# Altium project SHERPA.PrjPcb
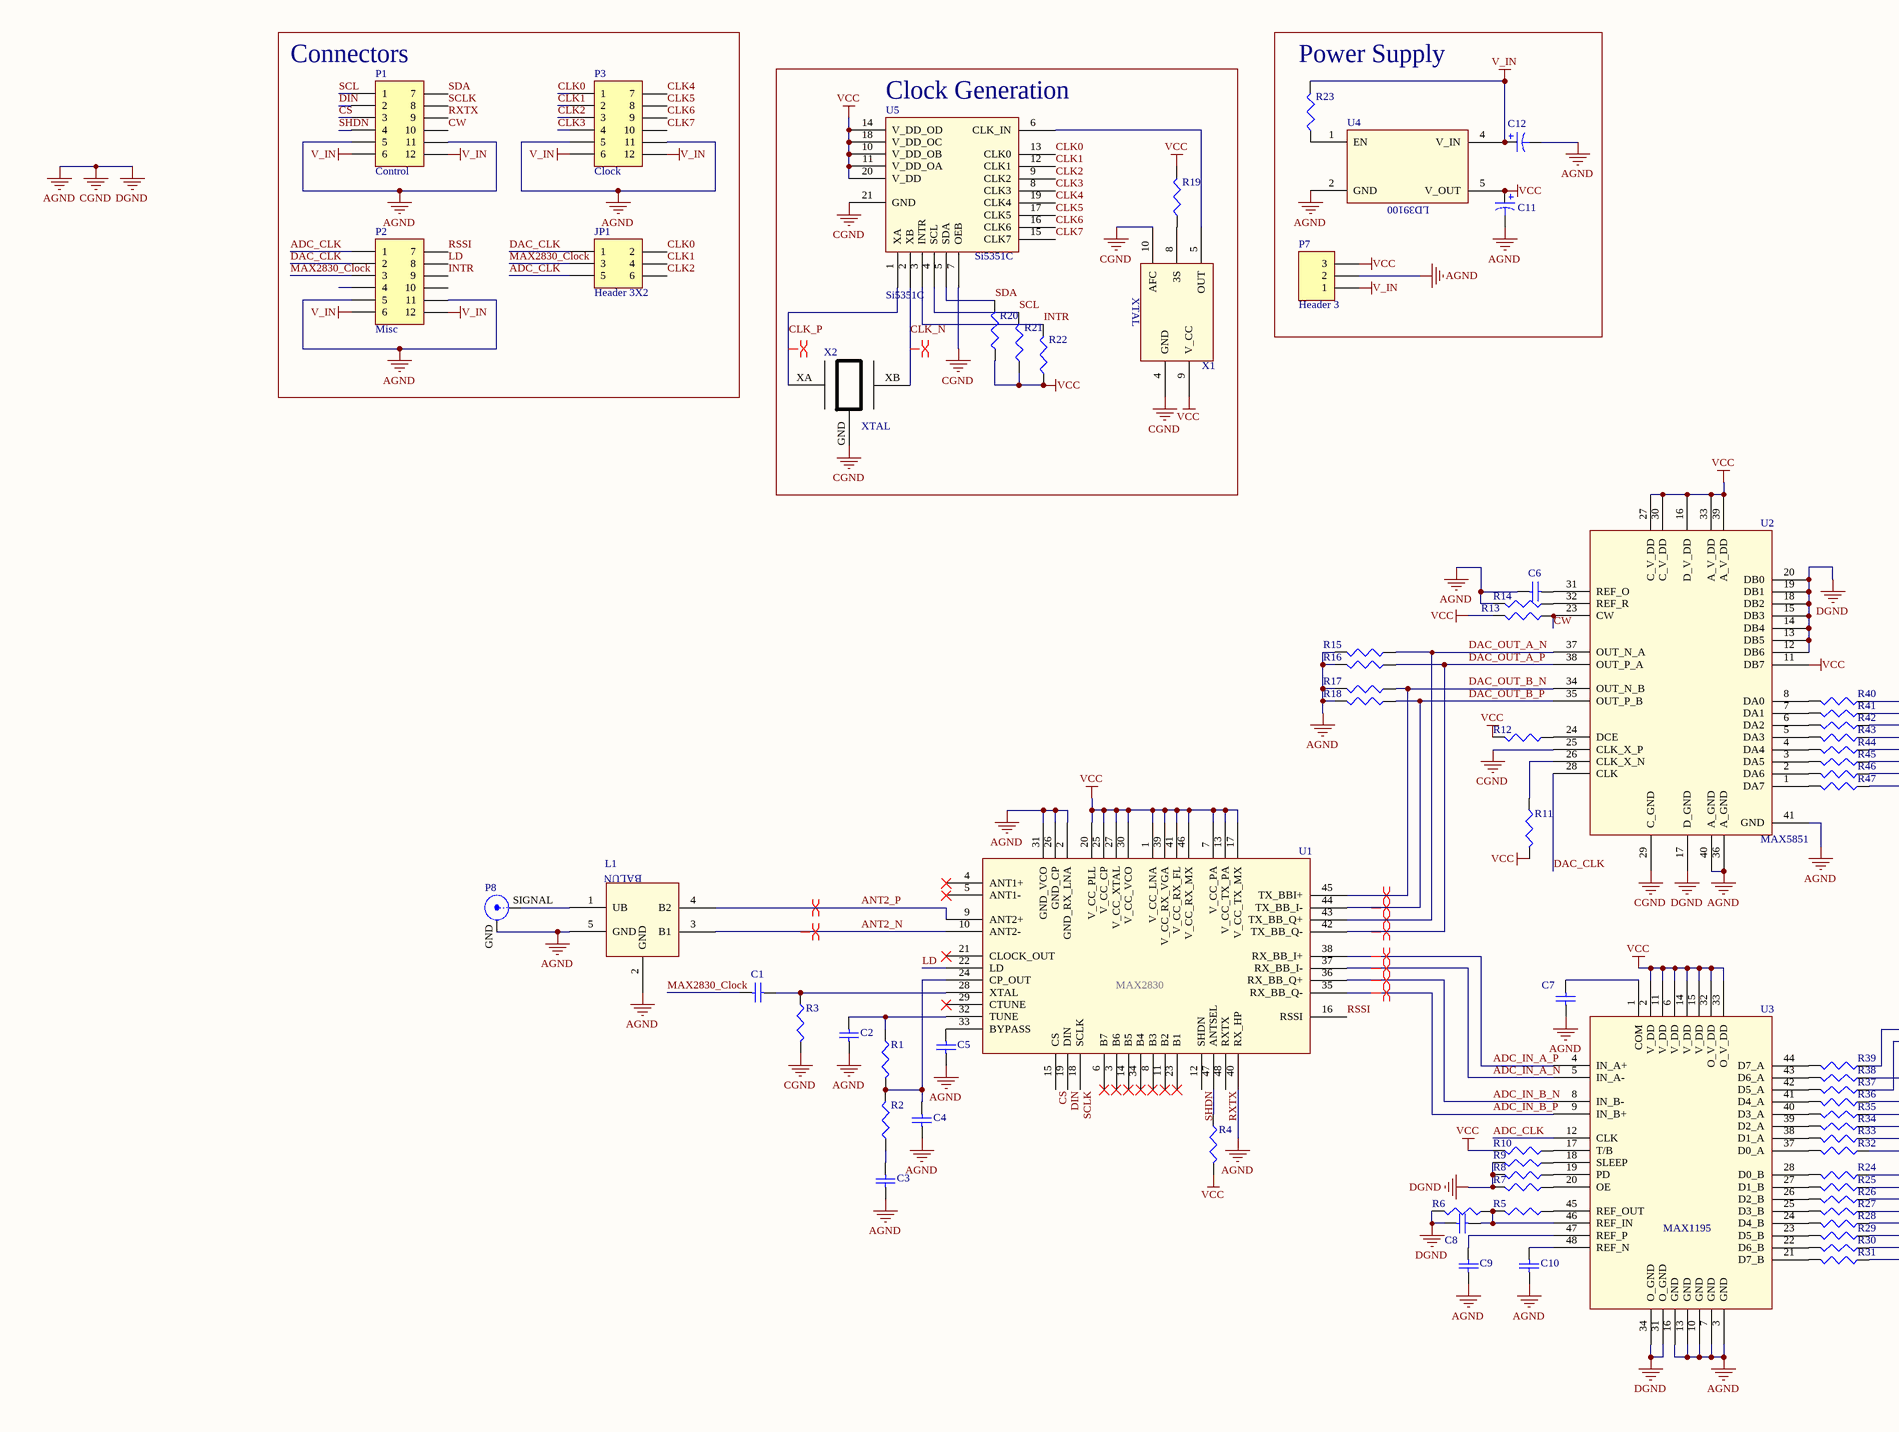
[diagram p0: Schematic_SHERPA.SchDoc, left]
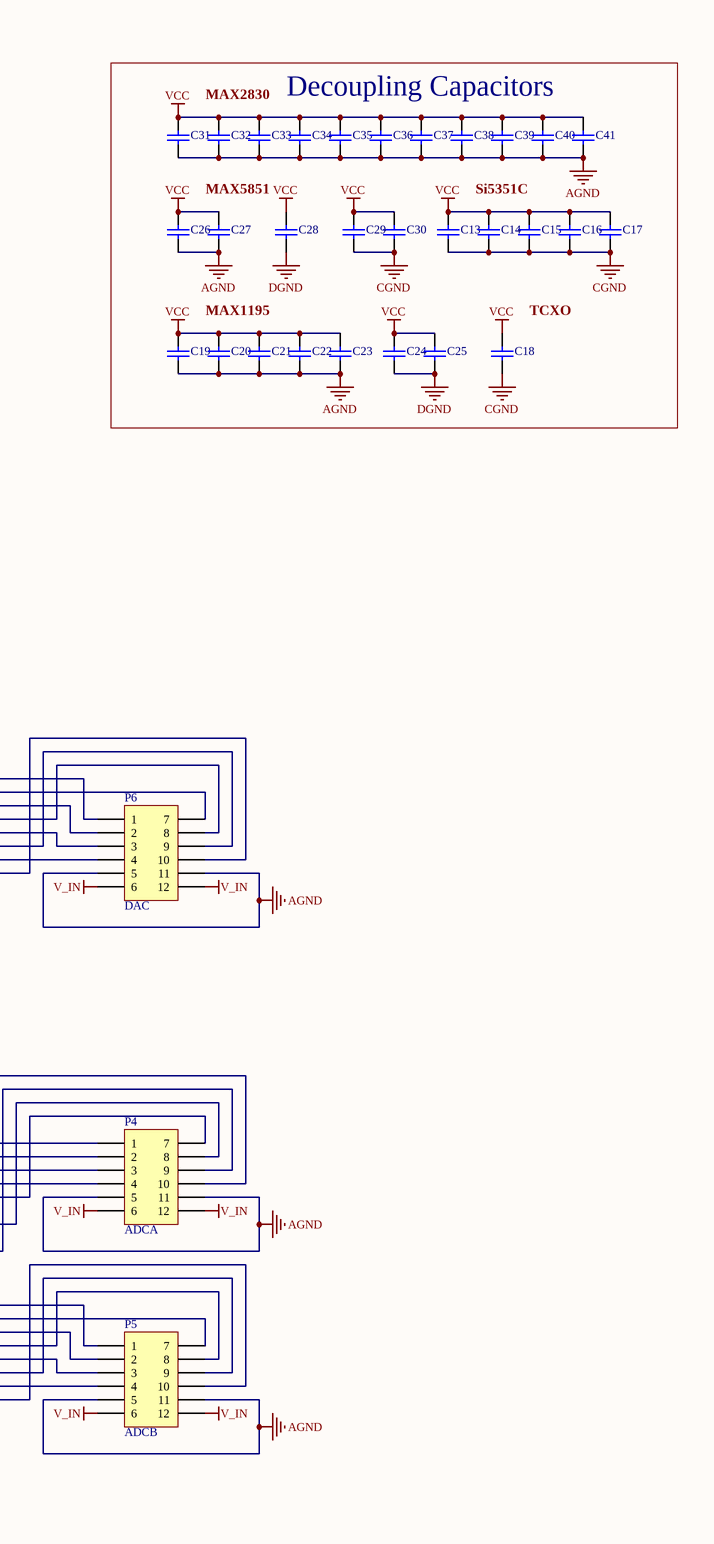
[diagram p1: Schematic_SHERPA.SchDoc, right]
1 sheet, 105 parts. Net scope: global (net labels, ports and power ports of the same name join across sheets).
Board files: PCB_SHERPA_MK_II.PcbDoc, PCB_SHERPA_MK_I.PcbDoc

## Sheet Schematic_SHERPA.SchDoc
size A2

### Parts
C1  Cap Semi  [0402]  (value not drawn)
C2  Cap Semi  [0402]  (value not drawn)
C3  Cap Semi  [0402]  (value not drawn)
C4  Cap Semi  [0402]  (value not drawn)
C5  Cap Semi  [0402]  (value not drawn)
C6  Cap Semi  [0402]  (value not drawn)
C7  Cap Semi  [0402]  (value not drawn)
C8  Cap Semi  [0402]  (value not drawn)
C9  Cap Semi  [0402]  (value not drawn)
C10  Cap Semi  [0402]  (value not drawn)
C11  Cap Pol3  [C0805]  (value not drawn)
C12  Cap Pol3  [C0805]  (value not drawn)
C13  Cap Semi  [0402]  (value not drawn)
C14  Cap Semi  [0402]  (value not drawn)
C15  Cap Semi  [0402]  (value not drawn)
C16  Cap Semi  [0402]  (value not drawn)
C17  Cap Semi  [0402]  (value not drawn)
C18  Cap Semi  [0402]  (value not drawn)
C19  Cap Semi  [0402]  (value not drawn)
C20  Cap Semi  [0402]  (value not drawn)
C21  Cap Semi  [0402]  (value not drawn)
C22  Cap Semi  [0402]  (value not drawn)
C23  Cap Semi  [0402]  (value not drawn)
C24  Cap Semi  [0402]  (value not drawn)
C25  Cap Semi  [0402]  (value not drawn)
C26  Cap Semi  [0402]  (value not drawn)
C27  Cap Semi  [0402]  (value not drawn)
C28  Cap Semi  [0402]  (value not drawn)
C29  Cap Semi  [0402]  (value not drawn)
C30  Cap Semi  [0402]  (value not drawn)
C31  Cap Semi  [0402]  (value not drawn)
C32  Cap Semi  [0402]  (value not drawn)
C33  Cap Semi  [0402]  (value not drawn)
C34  Cap Semi  [0402]  (value not drawn)
C35  Cap Semi  [0402]  (value not drawn)
C36  Cap Semi  [0402]  (value not drawn)
C37  Cap Semi  [0402]  (value not drawn)
C38  Cap Semi  [0402]  (value not drawn)
C39  Cap Semi  [0402]  (value not drawn)
C40  Cap Semi  [0402]  (value not drawn)
C41  Cap Semi  [0402]  (value not drawn)
JP1  Header 3X2  [HDR2X3]
L1  BALUN_2  [BALUN2]  (value not drawn)
P1  Control  [HDR2X6_CEN]
P2  Misc  [HDR2X6_CEN]
P3  Clock  [HDR2X6_CEN]
P4  ADCA  [HDR2X6_CEN]
P5  ADCB  [HDR2X6_CEN]
P6  DAC  [HDR2X6_CEN]
P7  Header 3  [HDR1X3]
P8  SMA  [SMA Connector]  (value not drawn)
R1  Res3  [0402]  (value not drawn)
R2  Res3  [0402]  (value not drawn)
R3  Res3  [0402]  (value not drawn)
R4  Res3  [0402]  (value not drawn)
R5  Res3  [0402]  (value not drawn)
R6  Res3  [0402]  (value not drawn)
R7  Res3  [0402]  (value not drawn)
R8  Res3  [0402]  (value not drawn)
R9  Res3  [0402]  (value not drawn)
R10  Res3  [0402]  (value not drawn)
R11  Res3  [0402]  (value not drawn)
R12  Res3  [0402]  (value not drawn)
R13  Res3  [0402]  (value not drawn)
R14  Res3  [0402]  (value not drawn)
R15  Res3  [0402]  (value not drawn)
R16  Res3  [0402]  (value not drawn)
R17  Res3  [0402]  (value not drawn)
R18  Res3  [0402]  (value not drawn)
R19  Res3  [0402]  (value not drawn)
R20  Res3  [0402]  (value not drawn)
R21  Res3  [0402]  (value not drawn)
R22  Res3  [0402]  (value not drawn)
R23  Res3  [0402]  (value not drawn)
R24  Res3  [0402]  (value not drawn)
R25  Res3  [0402]  (value not drawn)
R26  Res3  [0402]  (value not drawn)
R27  Res3  [0402]  (value not drawn)
R28  Res3  [0402]  (value not drawn)
R29  Res3  [0402]  (value not drawn)
R30  Res3  [0402]  (value not drawn)
R31  Res3  [0402]  (value not drawn)
R32  Res3  [0402]  (value not drawn)
R33  Res3  [0402]  (value not drawn)
R34  Res3  [0402]  (value not drawn)
R35  Res3  [0402]  (value not drawn)
R36  Res3  [0402]  (value not drawn)
R37  Res3  [0402]  (value not drawn)
R38  Res3  [0402]  (value not drawn)
R39  Res3  [0402]  (value not drawn)
R40  Res3  [0402]  (value not drawn)
R41  Res3  [0402]  (value not drawn)
R42  Res3  [0402]  (value not drawn)
R43  Res3  [0402]  (value not drawn)
R44  Res3  [0402]  (value not drawn)
R45  Res3  [0402]  (value not drawn)
R46  Res3  [0402]  (value not drawn)
R47  Res3  [0402]  (value not drawn)
U1  MAX2830  [MAX2830]  (value not drawn)
U2  MAX5851  [MAX5851]  (value not drawn)
U3  MAX1195  [MAX1195]  (value not drawn)
U4  XD6220  [XC 6220]  (value not drawn)
U5  Si5351C  [Si5351C]
X1  7N-25.000MBP-T  [7N-25.000MBP-T]  (value not drawn)
X2  XTAL  [XTAL]

### Blocks framed on the sheet
Connectors: JP1 P1-P3
Clock Generation: R19-R22 U5 X1 X2
Power Supply: C11 C12 P7 R23 U4
Decoupling Capacitors: C13-C41

### Nets
AGND: C2.1 C3.1 C4.1 C5.1 C6.1 C7.1 C8.1 C9.1 C10.1 C11.2 C12.2 C13.2 C14.2 C15.2 C16.2 C17.2 C18.1 C19.2 C20.2 C21.2 C22.2 C23.2 C24.2 C25.2 C26.2 C27.2 C28.2 C29.2 C30.2 C31.2 C32.2 C33.2 C34.2 C35.2 C36.2 C37.2 C38.2 C39.2 C40.2 C41.2 L1.2(GND) L1.5(GND) P1.5 P1.11 P2.5 P2.11 P3.5 P3.11 P4.5 P4.11 P5.5 P5.11 P6.5 P6.11 P7.2 P8.GND(Y) R3.2 R6.2 R7.2 R8.2 R9.2 R14.2 R15.2 R16.2 R17.2 R18.2 U1.2(GND_RX_LNA) U1.26(GND_CP) U1.31(GND_VCO) U1.40(RX_HP) U2.12(DB6) U2.13(DB5) U2.14(DB4) U2.15(DB3) U2.17(D_GND) U2.18(DB2) U2.19(DB1) U2.20(DB0) U2.25(CLK_X_P) U2.29(C_GND) U2.36(A_GND) U2.40(A_GND) U2.41(GND) U3.3(GND) U3.7(GND) U3.10(GND) U3.13(GND) U3.16(GND) U3.31(O_GND) U3.34(O_GND) U4.2(GND) U5.7(OEB) U5.21(GND) X1.4(GND) X1.10(AFC) X2.GND  [also labelled CGND, DGND]
V_IN: C12.1 P1.6 P1.12 P2.6 P2.12 P3.6 P3.12 P4.6 P4.12 P5.6 P5.12 P6.6 P6.12 P7.1 R23.2 U4.4(V_IN)
VCC: C11.1 C13.1 C14.1 C15.1 C16.1 C17.1 C18.2 C19.1 C20.1 C21.1 C22.1 C23.1 C24.1 C25.1 C26.1 C27.1 C28.1 C29.1 C30.1 C31.1 C32.1 C33.1 C34.1 C35.1 C36.1 C37.1 C38.1 C39.1 C40.1 C41.1 P7.3 R4.2 R10.2 R11.2 R12.2 R13.2 R19.2 R20.1 R21.1 R22.1 U1.1(V_CC_LNA) U1.7(V_CC_PA) U1.13(V_CC_TX_PA) U1.17(V_CC_TX_MX) U1.20(V_CC_PLL) U1.25(V_CC_CP) U1.27(V_CC_XTAL) U1.30(V_CC_VCO) U1.39(V_CC_RX_VGA) U1.41(V_CC_RX_FL) U1.46(V_CC_RX_MX) U2.11(DB7) U2.16(D_V_DD) U2.27(C_V_DD) U2.30(C_V_DD) U2.33(A_V_DD) U2.39(A_V_DD) U3.2(V_DD) U3.6(V_DD) U3.11(V_DD) U3.14(V_DD) U3.15(V_DD) U3.32(O_V_DD) U3.33(O_V_DD) U4.5(V_OUT) U5.10(V_DD_OB) U5.11(V_DD_OA) U5.14(V_DD_OD) U5.18(V_DD_OC) U5.20(V_DD) X1.9(V_CC)
ADC_CLK: JP1.5 P2.1 U3.12(CLK)
ADC_IN_A_N: U1.37(RX_BB_I-) U3.5(IN_A-)
ADC_IN_A_P: U1.38(RX_BB_I+) U3.4(IN_A+)
ADC_IN_B_N: U1.36(RX_BB_Q+) U3.8(IN_B-)
ADC_IN_B_P: U1.35(RX_BB_Q-) U3.9(IN_B+)
ANT2_N: L1.3(B1) U1.10(ANT2-)
ANT2_P: L1.4(B2) U1.9(ANT2+)
CLK0: JP1.2 P3.1 U5.13(CLK0)
CLK1: JP1.4 P3.2 U5.12(CLK1)
CLK2: JP1.6 P3.3 U5.9(CLK2)
CLK3: P3.4 U5.8(CLK3)
CLK4: P3.7 U5.19(CLK4)
CLK5: P3.8 U5.17(CLK5)
CLK6: P3.9 U5.16(CLK6)
CLK7: P3.10 U5.15(CLK7)
CLK_N: U5.2(XB) X2.XB
CLK_P: U5.1(XA) X2.XA
CS: P1.3 U1.15(CS)
CW: P1.10 R13.1 U2.23(CW)
DAC_CLK: JP1.1 P2.2 U2.28(CLK)
DAC_OUT_A_N: R15.1 U1.43(TX_BB_Q+) U2.37(OUT_N_A)
DAC_OUT_A_P: R16.1 U1.42(TX_BB_Q-) U2.38(OUT_P_A)
DAC_OUT_B_N: R17.1 U1.45(TX_BBI+) U2.34(OUT_N_B)
DAC_OUT_B_P: R18.1 U1.44(TX_BB_I-) U2.35(OUT_P_B)
DIN: P1.2 U1.19(DIN)
INTR: P2.9 R22.2 U5.3(INTR)
LD: P2.8 U1.22(LD)
MAX2830_Clock: C1.1 JP1.3 P2.3
RSSI: P2.7 U1.16(RSSI)
RXTX: P1.9 U1.48(RXTX)
SCL: P1.1 R21.2 U5.4(SCL)
SCLK: P1.8 U1.18(SCLK)
SDA: P1.7 R20.2 U5.5(SDA)
SHDN: P1.4 U1.12(SHDN)
NetC1_2: C1.2 R3.1 U1.28(XTAL)
NetC2_2: C2.2 R1.1 U1.32(TUNE)
NetC3_2: C3.2 R2.1
NetC4_2: C4.2 R1.2 R2.2 U1.24(CP_OUT)
NetC5_2: C5.2 U1.33(BYPASS)
NetC6_2: C6.2 U2.31(REF_O)
NetC7_2: C7.2 U3.1(COM)
NetC8_2: C8.2 R5.2 R6.1 U3.46(REF_IN)
NetC9_2: C9.2 U3.47(REF_P)
NetC10_2: C10.2 U3.48(REF_N)
NetL1_1: L1.1(UB) P8.SIGNAL(X)
NetP4_1: P4.1 R39.1
NetP4_2: P4.2 R37.1
NetP4_3: P4.3 R35.1
NetP4_4: P4.4 R33.1
NetP4_7: P4.7 R38.1
NetP4_8: P4.8 R36.1
NetP4_9: P4.9 R34.1
NetP4_10: P4.10 R32.1
NetP5_1: P5.1 R24.1
NetP5_2: P5.2 R26.1
NetP5_3: P5.3 R28.1
NetP5_4: P5.4 R30.1
NetP5_7: P5.7 R25.1
NetP5_8: P5.8 R27.1
NetP5_9: P5.9 R29.1
NetP5_10: P5.10 R31.1
NetP6_1: P6.1 R40.1
NetP6_2: P6.2 R42.1
NetP6_3: P6.3 R44.1
NetP6_4: P6.4 R46.1
NetP6_7: P6.7 R41.1
NetP6_8: P6.8 R43.1
NetP6_9: P6.9 R45.1
NetP6_10: P6.10 R47.1
NetR4_1: R4.1 U1.47(ANTSEL)
NetR5_1: R5.1 U3.45(REF_OUT)
NetR7_1: R7.1 U3.20(OE)
NetR8_1: R8.1 U3.19(PD)
NetR9_1: R9.1 U3.18(SLEEP)
NetR10_1: R10.1 U3.17(T/B)
NetR11_1: R11.1 U2.26(CLK_X_N)
NetR12_1: R12.1 U2.24(DCE)
NetR14_1: R14.1 U2.32(REF_R)
NetR19_1: R19.1 X1.8(3S)
NetR23_1: R23.1 U4.1(EN)
NetR24_2: R24.2 U3.28(D0_B)
NetR25_2: R25.2 U3.27(D1_B)
NetR26_2: R26.2 U3.26(D2_B)
NetR27_2: R27.2 U3.25(D3_B)
NetR28_2: R28.2 U3.24(D4_B)
NetR29_2: R29.2 U3.23(D5_B)
NetR30_2: R30.2 U3.22(D6_B)
NetR31_2: R31.2 U3.21(D7_B)
NetR32_2: R32.2 U3.37(D0_A)
NetR33_2: R33.2 U3.38(D1_A)
NetR34_2: R34.2 U3.39(D2_A)
NetR35_2: R35.2 U3.40(D3_A)
NetR36_2: R36.2 U3.41(D4_A)
NetR37_2: R37.2 U3.42(D5_A)
NetR38_2: R38.2 U3.43(D6_A)
NetR39_2: R39.2 U3.44(D7_A)
NetR40_2: R40.2 U2.8(DA0)
NetR41_2: R41.2 U2.7(DA1)
NetR42_2: R42.2 U2.6(DA2)
NetR43_2: R43.2 U2.5(DA3)
NetR44_2: R44.2 U2.4(DA4)
NetR45_2: R45.2 U2.3(DA5)
NetR46_2: R46.2 U2.2(DA6)
NetR47_2: R47.2 U2.1(DA7)
NetU5_6: U5.6(CLK_IN) X1.5(OUT)

Not connected (* = marked no-connect by the designer): P2 4 10; U1 3(B6)* 4(ANT1+)* 5(ANT1-)* 6(B7)* 8(B3)* 11(B2)* 14(B5)* 21(CLOCK_OUT)* 23(B1)* 29(CTUNE)* 34(B4)*

### Layout directives
differential pair: ADC_IN_A_N, ADC_IN_A_P, ADC_IN_B_N, ADC_IN_B_P, ANT2_N, ANT2_P, CLK_N, CLK_P, DAC_OUT_A_N, DAC_OUT_A_P, DAC_OUT_B_N, DAC_OUT_B_P

### Notes on the sheet
- MAX2830
- MAX5851
- Si5351C
- MAX1195
- (near C18) TCXO
- Title
- Size:
- Date:
- File:
- A2
- Number:
- Time:
- Revision:
- Sheet
- of
- (in symbol 7N-25.000MBP-T) XTAL
- (in symbol BALUN_2) BALUN
- (in symbol XD6220) LD39100

### Library data of the parts
C1 C4 C5 = Cap Semi: Capacitor (Semiconductor SIM Model); Value: 100pF; Published: 8-Jun-2000; LatestRevisionDate: 29-May-2009; LatestRevisionNote: IPC-7351 Footprint Added.; PackageReference: C1206; Publisher: Altium Limited; PackageDescription: Chip Capacitor
C2 = Cap Semi: Capacitor (Semiconductor SIM Model); Value: 68pF; Published: 8-Jun-2000; LatestRevisionDate: 29-May-2009; LatestRevisionNote: IPC-7351 Footprint Added.; PackageReference: C1206; Publisher: Altium Limited; PackageDescription: Chip Capacitor
C3 = Cap Semi: Capacitor (Semiconductor SIM Model); Value: 2200pF; Published: 8-Jun-2000; LatestRevisionDate: 29-May-2009; LatestRevisionNote: IPC-7351 Footprint Added.; PackageReference: C1206; Publisher: Altium Limited; PackageDescription: Chip Capacitor
C6-C10 C13-C41 = Cap Semi: Capacitor (Semiconductor SIM Model); Value: 100nF; Published: 8-Jun-2000; LatestRevisionDate: 29-May-2009; LatestRevisionNote: IPC-7351 Footprint Added.; PackageReference: C1206; Publisher: Altium Limited; PackageDescription: Chip Capacitor
C11 = Cap Pol3: Polarized Capacitor (Surface Mount); Value: 4.7uF; Published: 8-Jun-2000; LatestRevisionDate: 29-May-2009; LatestRevisionNote: IPC-7351 Footprint Added.; PackageReference: C0805; Publisher: Altium Limited; PackageDescription: Chip Capacitor
C12 = Cap Pol3: Polarized Capacitor (Surface Mount); Value: 10uF; Published: 8-Jun-2000; LatestRevisionDate: 29-May-2009; LatestRevisionNote: IPC-7351 Footprint Added.; PackageReference: C0805; Publisher: Altium Limited; PackageDescription: Chip Capacitor
JP1 = Header 3X2: Header, 3-Pin, Dual row; LatestRevisionDate: 17-Jul-2002; LatestRevisionNote: Re-released for DXP Platform.; Publisher: Altium Limited
P1-P6 = Header 6X2A: Header, 6-Pin, Dual row; LatestRevisionDate: 17-Jul-2002; LatestRevisionNote: Re-released for DXP Platform.; Publisher: Altium Limited
P7 = Header 3: Header, 3-Pin; LatestRevisionDate: 17-Jul-2002; LatestRevisionNote: Re-released for DXP Platform.; Publisher: Altium Limited
P8 = BNC: BNC Elbow Connector; LatestRevisionDate: 17-Jul-2002; LatestRevisionNote: Re-released for DXP Platform.; Publisher: Altium Limited
R1 = Res3: Resistor; Value: 750; Published: 8-Jun-2000; LatestRevisionDate: 29-May-2009; LatestRevisionNote: IPC-7351 Footprint Added.; PackageReference: J1-0603; Publisher: Altium Limited; PackageDescription: Chip Resistor
R2 = Res3: Resistor; Value: 1.2K; Published: 8-Jun-2000; LatestRevisionDate: 29-May-2009; LatestRevisionNote: IPC-7351 Footprint Added.; PackageReference: J1-0603; Publisher: Altium Limited; PackageDescription: Chip Resistor
R3 = Res3: Resistor; Value: 2K; Published: 8-Jun-2000; LatestRevisionDate: 29-May-2009; LatestRevisionNote: IPC-7351 Footprint Added.; PackageReference: J1-0603; Publisher: Altium Limited; PackageDescription: Chip Resistor
R4 R19 R23 = Res3: Resistor; Value: 10K; Published: 8-Jun-2000; LatestRevisionDate: 29-May-2009; LatestRevisionNote: IPC-7351 Footprint Added.; PackageReference: J1-0603; Publisher: Altium Limited; PackageDescription: Chip Resistor
R5-R12 = Res3: Resistor; Value: 10k; Published: 8-Jun-2000; LatestRevisionDate: 29-May-2009; LatestRevisionNote: IPC-7351 Footprint Added.; PackageReference: J1-0603; Publisher: Altium Limited; PackageDescription: Chip Resistor
R13 R14 = Res3: Resistor; Value: 1.9k; Published: 8-Jun-2000; LatestRevisionDate: 29-May-2009; LatestRevisionNote: IPC-7351 Footprint Added.; PackageReference: J1-0603; Publisher: Altium Limited; PackageDescription: Chip Resistor
R15-R18 = Res3: Resistor; Value: 100; Published: 8-Jun-2000; LatestRevisionDate: 29-May-2009; LatestRevisionNote: IPC-7351 Footprint Added.; PackageReference: J1-0603; Publisher: Altium Limited; PackageDescription: Chip Resistor
R20 R21 = Res3: Resistor; Value: 1K; Published: 8-Jun-2000; LatestRevisionDate: 29-May-2009; LatestRevisionNote: IPC-7351 Footprint Added.; PackageReference: J1-0603; Publisher: Altium Limited; PackageDescription: Chip Resistor
R22 = Res3: Resistor; Value: 1.5K; Published: 8-Jun-2000; LatestRevisionDate: 29-May-2009; LatestRevisionNote: IPC-7351 Footprint Added.; PackageReference: J1-0603; Publisher: Altium Limited; PackageDescription: Chip Resistor
R24-R47 = Res3: Resistor; Value: 200; Published: 8-Jun-2000; LatestRevisionDate: 29-May-2009; LatestRevisionNote: IPC-7351 Footprint Added.; PackageReference: J1-0603; Publisher: Altium Limited; PackageDescription: Chip Resistor